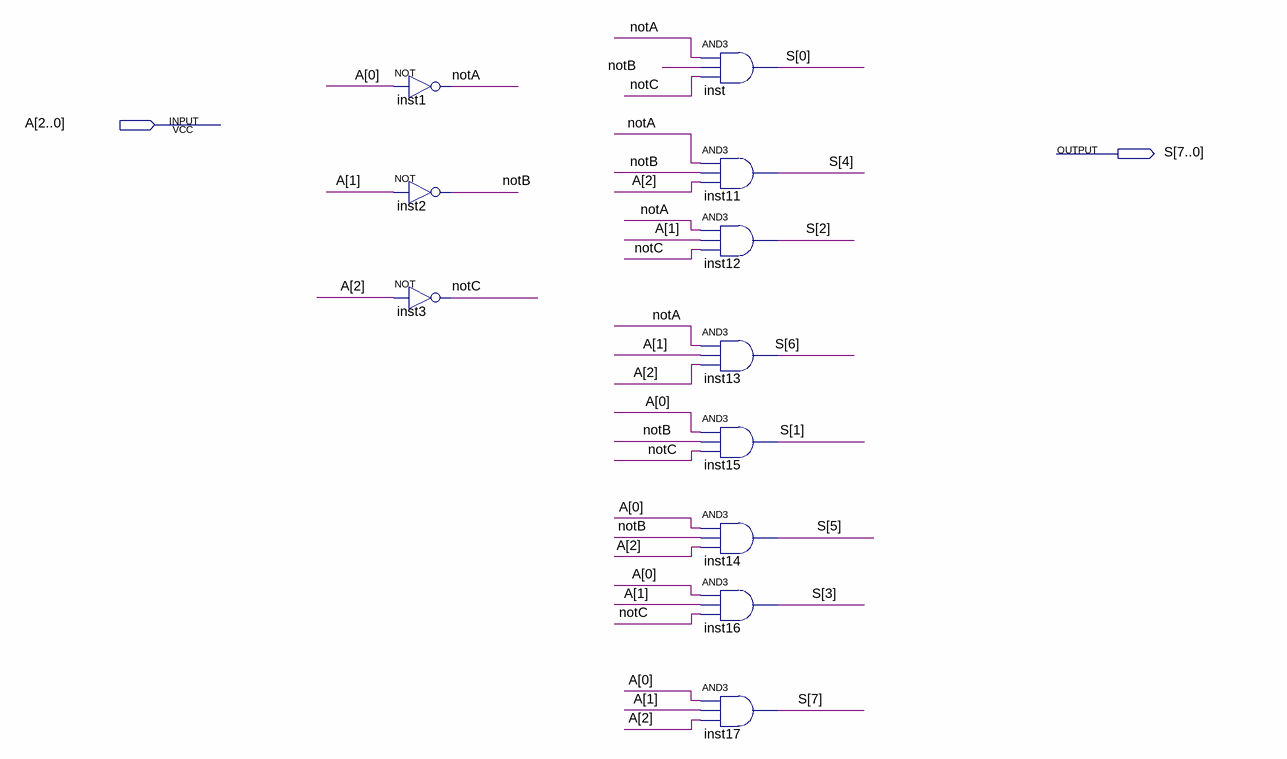
[diagram p0: schematic sheet]
// Quartus schematic Decoder3x8.bdf as structural Verilog: 11 symbols, 2 pins
module Decoder3x8 (
  input  [2:0] A,
  output [7:0] S
);

  wire notA, notB, notC;

  not inst1 (notA, A[0]);
  not inst2 (notB, A[1]);
  not inst3 (notC, A[2]);
  and inst (S[0], notA, notB, notC);
  and inst11 (S[4], notA, notB, A[2]);
  and inst12 (S[2], notA, A[1], notC);
  and inst13 (S[6], notA, A[1], A[2]);
  and inst15 (S[1], A[0], notB, notC);
  and inst14 (S[5], A[0], notB, A[2]);
  and inst16 (S[3], A[0], A[1], notC);
  and inst17 (S[7], A[0], A[1], A[2]);
endmodule
